# EAGLE design dc_controller_1 (EAGLE 4.16)
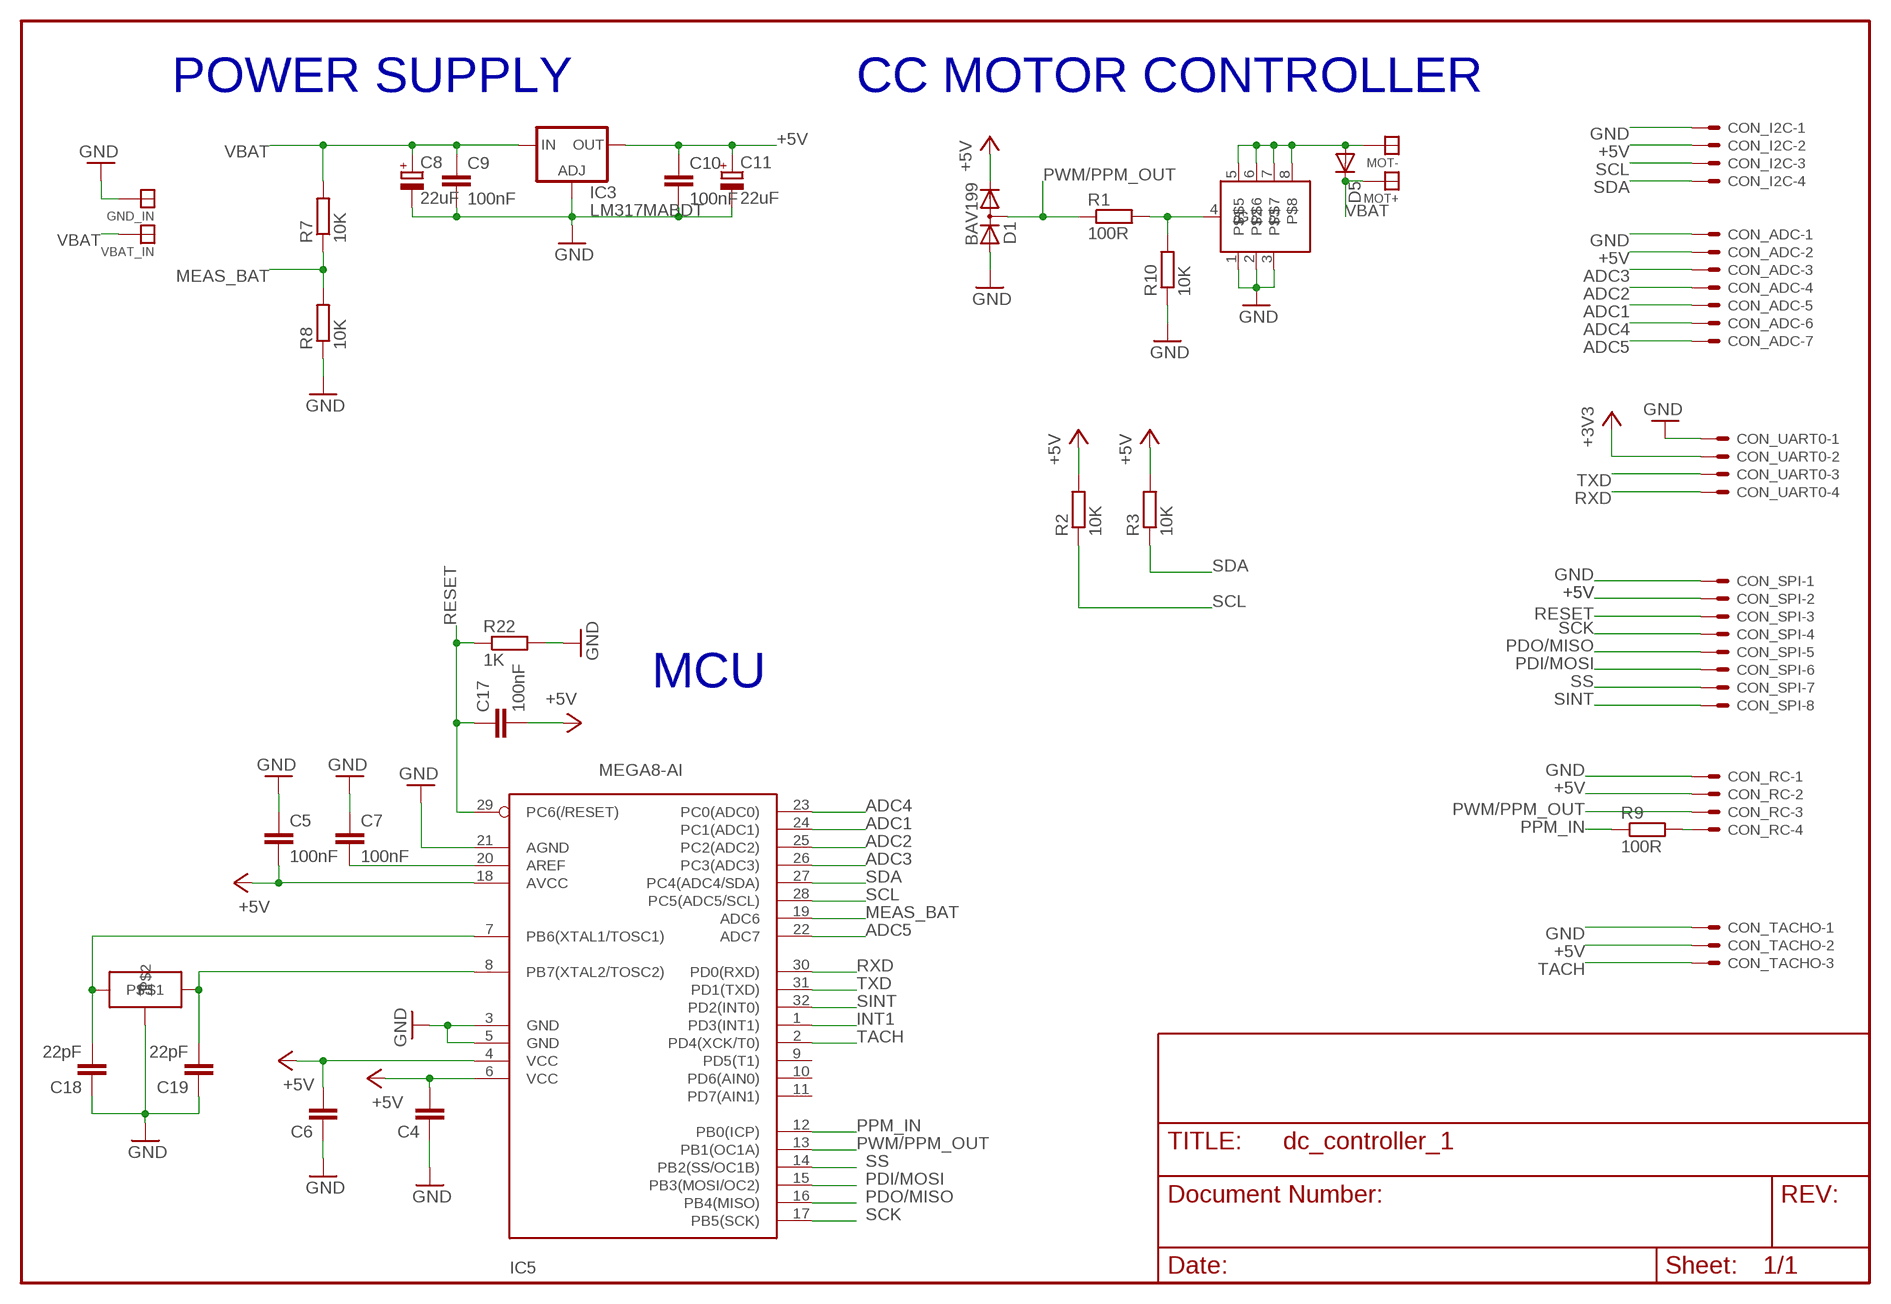
[diagram p0: schematic, sheet 1]

## Parts
C4  C-EUC0805K  [C0805K]
C5  100nF  C-EUC0805K  [C0805K]
C6  C-EUC0805K  [C0805K]
C7  100nF  C-EUC0805K  [C0805K]
C8  22uF  CPOL-EUD/7343-31R  [D/7343-31R]
C9  100nF  C-EUC0805K  [C0805K]
C10  100nF  C-EUC0805K  [C0805K]
C11  22uF  CPOL-EUD/7343-31R  [D/7343-31R]
C17  100nF  C-EUC0805K  [C0805K]
C18  22pF  C-EUC0805K  [C0805K]
C19  22pF  C-EUC0805K  [C0805K]
CON_ADC  53047-07  [53047-07]
CON_I2C  53047-04  [53047-04]
CON_RC  53047-04  [53047-04]
CON_SPI  53047-08  [53047-08]
CON_TACHO  53047-03  [53047-03]
CON_UART0  53047-04  [53047-04]
D1  BAV199  [SOT23]
D5  DIODE-DO214BA  [DO-214BA]
GND_IN  SOLDER_PAD200_50  [SOLDER_PAD_200_50]
IC3  LM317MABDT  [DPACK]
IC5  MEGA8-AI  [TQFP32-08]
MOT+  SOLDER_PAD200_50  [SOLDER_PAD_200_50]
MOT-  SOLDER_PAD200_50  [SOLDER_PAD_200_50]
R1  100R  R-EU_R0805  [R0805]
R2  10K  R-EU_R0805  [R0805]
R3  10K  R-EU_R0805  [R0805]
R7  10K  R-EU_R0805  [R0805]
R8  10K  R-EU_R0805  [R0805]
R9  100R  R-EU_R0805  [R0805]
R10  10K  R-EU_R0805  [R0805]
R22  1K  R-EU_R0805  [R0805]
U$4  IRF7809  [SO08]
U$9  MICRO_RESO  [MICRO_CRYSTAL]
VBAT_IN  SOLDER_PAD200_50  [SOLDER_PAD_200_50]

## Nets
+5V: C4.2 C5.2 C6.2 C10.1 C11.+ C17.2 CON_ADC.2 CON_I2C.2 CON_RC.2 CON_SPI.2 CON_TACHO.2 CON_UART0.2 D1.2(C) IC3.4(OUT) IC5.4(VCC) IC5.6(VCC) IC5.18(AVCC) R2.2 R3.2 ; supply symbol labelled +3V3
ADC1: CON_ADC.5 IC5.24(PC1(ADC1))
ADC2: CON_ADC.4 IC5.25(PC2(ADC2))
ADC3: CON_ADC.3 IC5.26(PC3(ADC3))
ADC4: CON_ADC.6 IC5.23(PC0(ADC0))
ADC5: CON_ADC.7 IC5.22(ADC7)
GND: C4.1 C5.1 C6.1 C7.1 C8.- C9.2 C10.2 C11.- C18.1 C19.1 CON_ADC.1 CON_I2C.1 CON_RC.1 CON_SPI.1 CON_TACHO.1 CON_UART0.1 D1.1(A) GND_IN.P$1 IC3.1(ADJ) IC5.3(GND) IC5.5(GND) IC5.21(AGND) R8.1 R10.1 R22.2 U$4.1 U$4.2 U$4.3 U$9.P$2
INT1: IC5.1(PD3(INT1))
MEAS_BAT: IC5.19(ADC6) R7.1 R8.2
N$1: C19.2 IC5.8(PB7(XTAL2/TOSC2)) U$9.P$1
N$2: C18.2 IC5.7(PB6(XTAL1/TOSC1)) U$9.P$3
N$3: C7.2 IC5.20(AREF)
N$5: CON_RC.4 R9.2
N$9: R1.2 R10.2 U$4.4(G)
N$13: D5.A MOT-.P$1 U$4.5 U$4.6 U$4.7 U$4.8
PDI/MOSI: CON_SPI.6 IC5.15(PB3(MOSI/OC2))
PDO/MISO: CON_SPI.5 IC5.16(PB4(MISO))
PPM_IN: IC5.12(PB0(ICP)) R9.1
PWM/PPM_OUT: CON_RC.3 D1.3(AC) IC5.13(PB1(OC1A)) R1.1
RESET: C17.1 CON_SPI.3 IC5.29(PC6(/RESET)) R22.1
RXD: CON_UART0.4 IC5.30(PD0(RXD))
SCK: CON_SPI.4 IC5.17(PB5(SCK))
SCL: CON_I2C.3 IC5.28(PC5(ADC5/SCL)) R2.1
SDA: CON_I2C.4 IC5.27(PC4(ADC4/SDA)) R3.1
SINT: CON_SPI.8 IC5.32(PD2(INT0))
SS: CON_SPI.7 IC5.14(PB2(SS/OC1B))
TACH: CON_TACHO.3 IC5.2(PD4(XCK/T0))
TXD: CON_UART0.3 IC5.31(PD1(TXD))
VBAT: C8.+ C9.1 D5.C IC3.3(IN) MOT+.P$1 R7.2 VBAT_IN.P$1
Unconnected: IC5.9(PD5(T1)) IC5.10(PD6(AIN0)) IC5.11(PD7(AIN1))

## Notes on the sheet
- POWER SUPPLY | CC MOTOR CONTROLLER
- MCU

## Library data of the parts
C4-C7 C9 C10 C17-C19 = rcl:C-EU: CAPACITOR, European symbol
C8 C11 = rcl:CPOL-EU: POLARIZED CAPACITOR, European symbol
CON_ADC = con-molex:53?-07: CONNECTOR wire to board 1.25 mm (.049 inch) pitch header
CON_I2C CON_RC CON_UART0 = con-molex:53?-04: CONNECTOR wire to board 1.25 mm (.049 inch) pitch header
CON_SPI = con-molex:53?-08: CONNECTOR wire to board 1.25 mm (.049 inch) pitch header
CON_TACHO = con-molex:53?-03: CONNECTOR wire to board 1.25 mm (.049 inch) pitch header
D1 = diode:BAV199: DIODE low-leakage double diode
D5 = diode:DIODE-: DIODE
GND_IN MOT+ MOT- VBAT_IN = paparazzi:SOLDER_PAD
IC3 = v-reg:LM317?*: 500 mA Adjustable Output Positive Voltage Regulator Source: http://www.onsemi.co.jp .. LM317M-D.PDF
IC5 = atmel:MEGA8: MICROCONTROLLER 8 Kbytes FLASH 1 kbytes SRAM 512 bytes EEPROM USART 6-channel 10 bit ADC 2-channel 8 bit ADC
R1-R3 R7-R10 R22 = rcl:R-EU_: RESISTOR, European symbol
U$4 = paparazzi:IRF7809
U$9 = paparazzi:MICRO_RESO

## Board
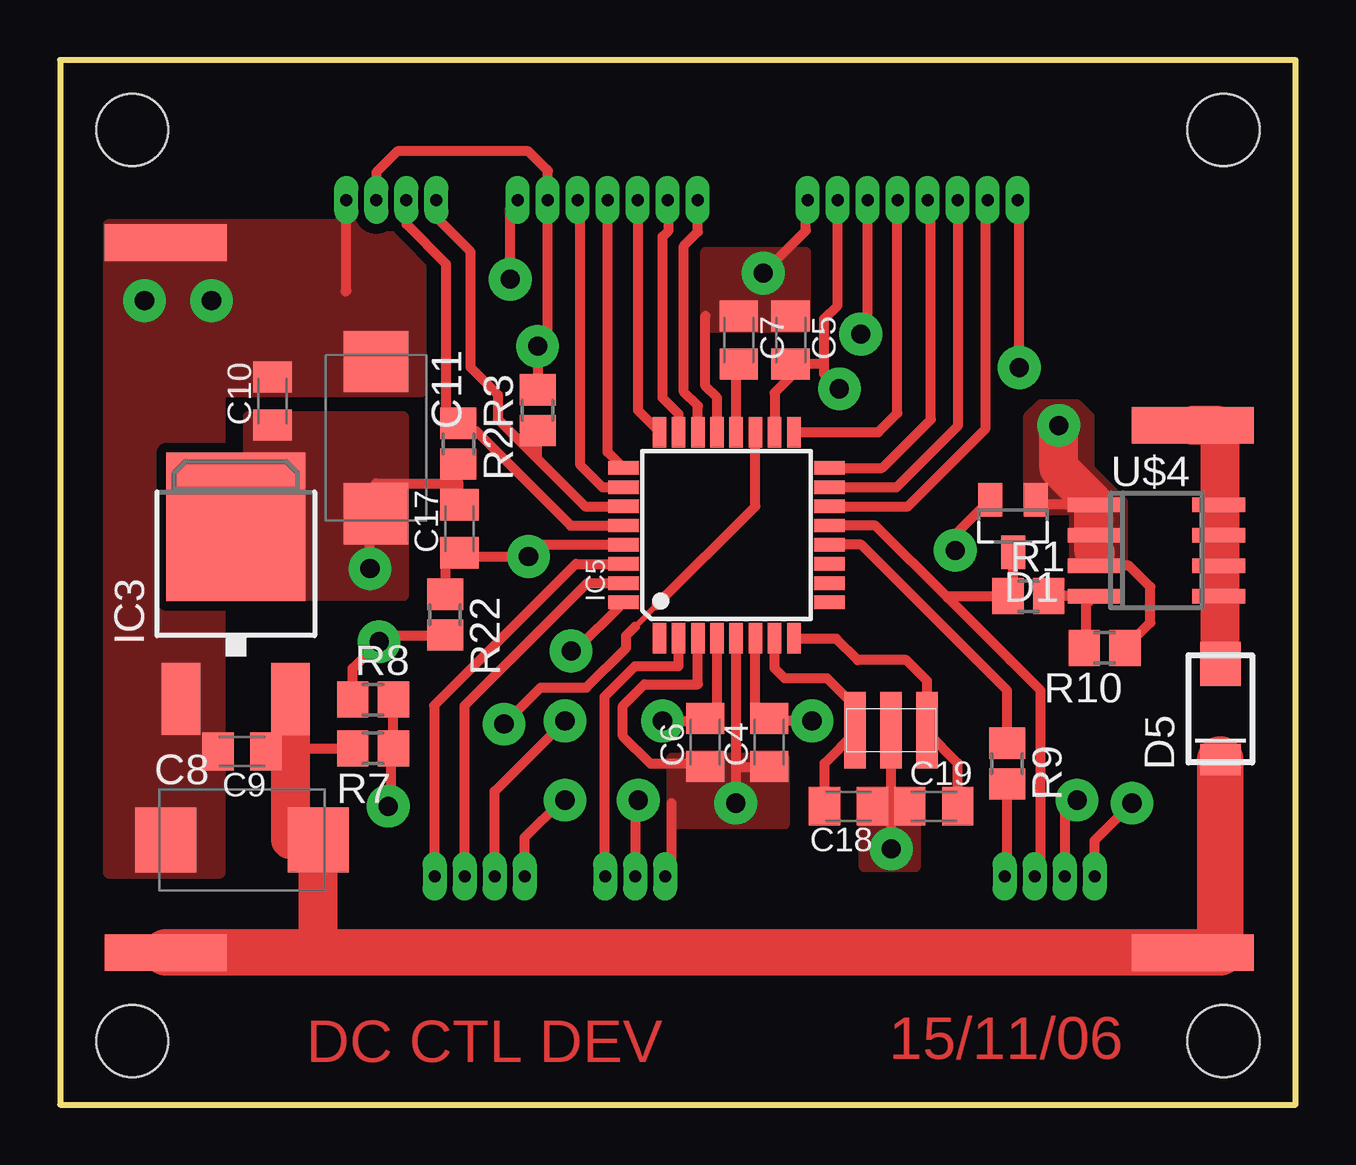
[diagram p1: board, top side]
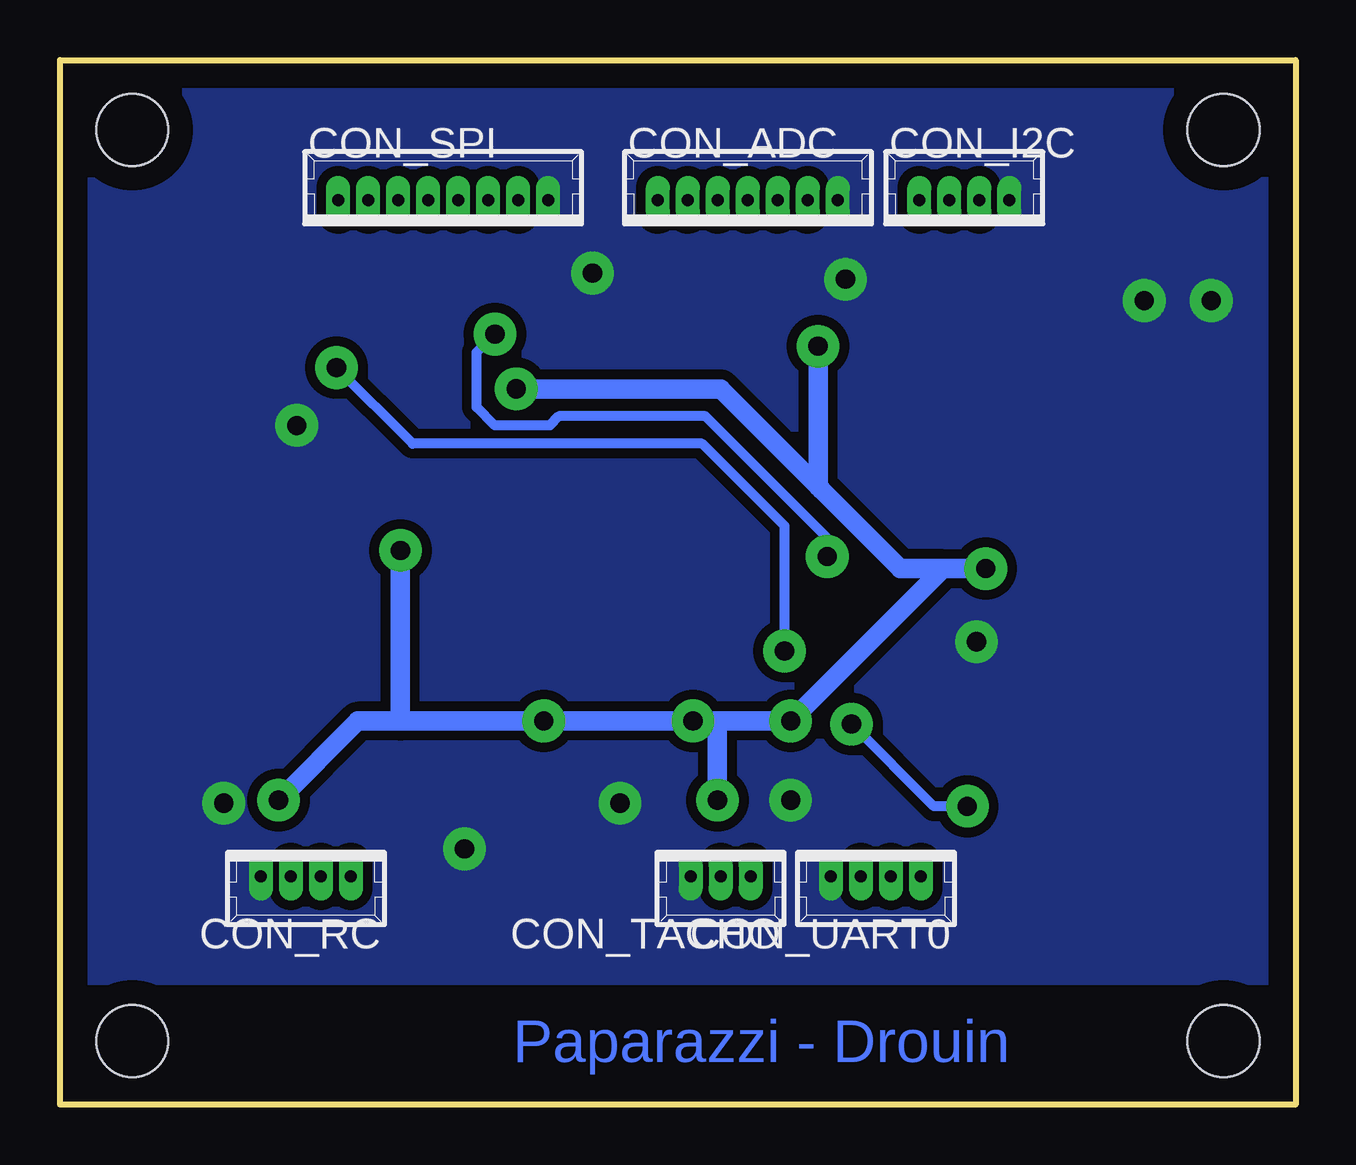
[diagram p2: board, bottom side, seen from below]

Size 51.49 x 43.55 mm. Coordinates in mm from the lower left corner, seen from the top.
Outline: 0,0 51.49,0 51.49,43.55 0,43.55 0,0
Copper layers (1*16): Top 0.035mm / dielectric 1.5mm / Bottom 0.035mm
Design rules "default": minimum track width 10mil, minimum drill 24mil, track to track 8mil, track to pad 8mil, pad to pad 8mil, via to via 8mil, smd to smd 8mil, copper to edge 40mil, drill to drill 8mil, minimum pad ring 10mil, minimum via ring 8mil, stop-mask expansion 4mil, vias tented up to drill 0mil, thermal gap 10mil
Holes 3 mm at 3.01,2.66 48.48,40.63 48.48,2.66 3.01,40.63

### Footprints (pad centres in the part's own frame; a part is rotated, then mirrored left to right if it is on the bottom)
C0805K = smd 1.3 x 1.6: 1 -1,0; 2 1,0
D/7343-31R = smd 2.55 x 2.7: + 3.175,0; - -3.175,0
53047-07 = drill 0.5 pad 0.698 long: 1 3.75,0; 2 2.5,0; 3 1.25,0; 4 0,0; 5 -1.25,0; 6 -2.5,0; 7 -3.75,0
53047-04 = drill 0.5 pad 0.698 long: 1 1.875,0; 2 0.625,0; 3 -0.625,0; 4 -1.875,0
53047-08 = drill 0.5 pad 0.698 long: 1 4.375,0; 2 3.125,0; 3 1.875,0; 4 0.625,0; 5 -0.625,0; 6 -1.875,0; 7 -3.125,0; 8 -4.375,0
53047-03 = drill 0.5 pad 0.698 long: 1 1.25,0; 2 0,0; 3 -1.25,0
SOT23 = smd 1 x 1.4: 1 -0.95,-1.1; 2 0.95,-1.1; 3 0,1.1
DO-214BA = smd 1.85 x 1.68: A 1.87,0 | smd 1.32 x 1.68: C -2.12,0
SOLDER_PAD_200_50 = smd 5.08 x 1.524: P$1 0,0
DPACK = smd 1.6 x 3: 1 -2.28,-4.8; 3 2.28,-4.8 | smd 5.8 x 6.2: 4 0,2.38
TQFP32-08 = smd 1.27 x 0.559: 1 -4.293,2.8; 2 -4.293,2; 3 -4.293,1.2; 4 -4.293,0.4; 5 -4.293,-0.4; 6 -4.293,-1.2; 7 -4.293,-2; 8 -4.293,-2.8; 17 4.293,-2.8; 18 4.293,-2; 19 4.293,-1.2; 20 4.293,-0.4; 21 4.293,0.4; 22 4.293,1.2; 23 4.293,2; 24 4.293,2.8 | smd 0.559 x 1.27: 9 -2.8,-4.293; 10 -2,-4.293; 11 -1.2,-4.293; 12 -0.4,-4.293; 13 0.4,-4.293; 14 1.2,-4.293; 15 2,-4.293; 16 2.8,-4.293; 25 2.8,4.293; 26 2,4.293; 27 1.2,4.293; 28 0.4,4.293; 29 -0.4,4.293; 30 -1.2,4.293; 31 -2,4.293; 32 -2.8,4.293
R0805 = smd 1.3 x 1.5: 1 -0.85,0; 2 0.85,0
SO08 = smd 0.6 x 2.2: 1 -1.905,-2.6; 2 -0.635,-2.6; 3 0.635,-2.6; 4 1.905,-2.6; 5 1.905,2.6; 6 0.635,2.6; 7 -0.635,2.6; 8 -1.905,2.6
MICRO_CRYSTAL = smd 0.9 x 3.2: P$1 -1.5,0; P$2 0,0; P$3 1.5,0

### Placement (x,y rotation side)
C4  29.55,15.11 90 top
C5  30.44,31.87 270 top
C6  26.89,15.11 90 top
C7  28.28,31.87 270 top
C8  7.58,11.04 0 top
C9  7.58,14.73 180 top
C10  8.85,29.33 90 top
C11  13.17,27.81 270 top
C17  16.64,24.01 90 top
C18  32.85,12.44 180 top
C19  36.41,12.44 0 top
CON_ADC  22.82,37.71 0 bottom
CON_I2C  13.8,37.71 0 bottom
CON_RC  41.24,9.52 180 bottom
CON_SPI  35.52,37.71 0 bottom
CON_TACHO  23.96,9.52 180 bottom
CON_UART0  17.49,9.52 180 bottom
D1  39.71,24.12 180 top
D5  48.35,16.5 90 top
GND_IN  4.41,35.94 180 top
IC3  7.33,21.71 0 top
IC5  27.78,23.74 90 top
MOT+  4.41,6.34 0 top
MOT-  47.21,28.32 180 top
R1  40.35,21.2 0 top
R2  16.6,27.55 270 top
R3  19.9,28.95 90 top
R7  13.04,14.85 180 top
R8  13.04,16.89 0 top
R9  39.46,14.22 270 top
R10  43.52,19.05 180 top
R22  16.05,20.43 270 top
U$4  45.68,23.11 270 top
U$9  34.63,15.62 180 top
VBAT_IN  47.21,6.34 0 top

### Tracks (layer width: path | path; a pad name or v marks a point on that pad's centre or on a via)
+5V  (via drill 0.8 pad 1.78)
  Top 0.406: IC5.6 28.98,16.7 29.55,16.12 C4.2 29.66,16 v31.33,16 | 26.89,16 C6.2 | IC5.4 27.38,16.49 26.89,16 | v25.11,16 26.89,16 | CON_TACHO.2 23.96,12.57 v24.09,12.7 | CON_UART0.2 18.11,13.07 v21.04,16 | IC5.18 29.78,29.68 30.44,30.35 C5.2 | C5.2 30.44,30.98 | CON_RC.2 41.86,12.18 v42.38,12.7 | CON_SPI.2 32.4,33.32 31.84,32.76 31.84,30.86 | v12.92,22.35 12.92,25.52 | R3.2 v19.9,31.62 20.33,32.05 20.33,37.66 20.28,37.71 CON_ADC.2 20.32,38.94 20.28,38.98 | C11.+ 13.17,25.9 16.6,25.9 | 16.6,25.9 R2.2 | C17.2 16.6,25.01 16.6,25.9 | CON_I2C.2 13.18,38.87 14.06,39.75 19.52,39.75 20.28,38.98 | 20.28,38.98 20.33,38.93 | D1.2 37.3,23.76 v37.3,23.11 | 31.84,30.86 31.84,30.47 v32.47,29.84 | C5.2 31.82,30.87 31.84,30.86
  Bottom 0.813: 24.09,16 v21.04,16 14.69,22.35 | 24.09,16 v25.11,16 v31.33,16 37.3,16 | 24.09,16 v24.09,12.7 | 37.3,16 39.08,16 v42.38,12.7 | 19.77,25.65 16.47,22.35 14.69,22.35 | 19.77,25.65 19.9,25.78 v19.9,31.62 | 14.69,22.35 v12.92,22.35 | 37.3,16 v37.3,23.11 | v32.47,29.84 23.96,29.84 19.77,25.65
  pour Top (isolate 0.406, no thermals): 4.92,26.92 7.84,26.92 7.84,28.7 14.31,28.7 14.31,21.2 4.66,21.2 4.66,26.92 5.04,26.92
ADC1
  Top 0.406: 24.98,28.06 | IC5.24 24.98,28.06 | 24.98,28.06 24.09,28.94 24.09,37.71 CON_ADC.5
ADC2
  Top 0.406: 23.07,26.54 IC5.25 22.82,27.2 22.82,34.54 CON_ADC.4
ADC3
  Top 0.406: IC5.26 22.6,25.74 21.68,26.66 21.68,37.59 21.55,37.71 CON_ADC.3
ADC4
  Top 0.406: IC5.23 25.78,28.79 25.11,29.46 25.11,36.19 25.36,36.44 25.36,37.71 CON_ADC.6
ADC5
  Top 0.406: IC5.22 26.57,29.13 26,29.71 26,35.81 26.58,36.39 26.58,37.66 26.63,37.71 CON_ADC.7
GND  (via drill 0.8 pad 1.78)
  Top 0.406: 35.52,12.44 C19.1 34.63,12.44 | 34.63,12.44 C18.1 | 34.63,12.57 34.63,12.44 | 34.63,12.57 U$9.P$2 | C4.1 29.55,14.09 28.18,14.09 | 28.18,14.09 IC5.5 | IC5.3 26.57,17.52 24.35,17.52 23.46,16.63 23.46,15.36 24.6,14.22 26.89,14.22 C6.1 | 28.18,14.09 28.18,12.59 v28.16,12.57 | CON_TACHO.1 25.49,9.79 25.49,12.57 | v34.63,10.66 34.63,12.57 | v21.04,12.7 20.92,12.7 19.36,11.14 CON_UART0.1 | IC5.21 27.38,29.48 26.89,29.97 26.89,32.89 | CON_RC.1 43.11,11.01 v44.67,12.57 | CON_SPI.1 31.08,37.71 31.08,36.44 v29.3,34.67 | 43.14,22.98 42.89,22.73 42.89,22.47 U$4.3 44.54,22.47 45.43,21.59 45.43,20.1 R10.1 | 43.08,23.11 43.14,23.11 43.08,23.17 U$4.2 | 43.08,24.38 43.02,24.38 43.08,24.45 U$4.1 40.86,25.01 40.66,25.21 D1.1 | R8.1 12.19,18.2 v13.3,19.3 13.55,19.55 16.08,19.55 | 16.08,19.55 16.09,19.55 | 16.08,19.55 R22.2 | CON_ADC.1 19.14,37.71 18.76,37.33 v18.76,34.41 | CON_I2C.1 11.93,33.93 11.9,33.9
  Top 1.626: 43.14,22.98 43.08,23.04 43.08,23.11 U$4.2 43.08,24.38 U$4.1 43.08,25.07 41.62,26.54 v41.62,28.32
  other vias: 3.52,33.52 6.31,33.52
  pour Top (no thermals): 30.19,14.47 30.19,11.68 25.49,11.68 25.49,14.47
  pour Top (no thermals): 33.49,12.95 35.65,12.95 35.65,9.9 33.49,9.9
  pour Top (no thermals): 26.89,35.55 31.08,35.55 31.08,32.38 26.89,32.38
  pour Bottom (isolate 0.406, no thermals): 0.34,43.17 51.27,43.17 51.27,5.2 0.34,5.2
  pour Top (isolate 0.406, no thermals): 1.99,9.65 6.69,9.65 6.69,29.71 15.07,29.71 15.07,36.7 1.99,36.7
  pour Top (no thermals): 40.35,24.76 40.35,28.7 40.86,29.2 42.38,29.2 42.89,28.7 42.89,26.54 44.28,25.14 44.28,22.47 42.25,22.47 42.25,24.76
MEAS_BAT  (via drill 0.8 pad 1.78)
  Top 0.254: 23.96,19.93 24.85,20.82
  Top 0.406: R8.2 13.93,16.89 13.89,16.85 R7.1 13.8,14.85 13.8,12.44 v13.68,12.44 | IC5.19 28.98,24.94 24.85,20.82 | v18.5,15.87 20.03,17.39 21.93,17.39 23.58,19.05 23.58,19.55 23.96,19.93
  Bottom 0.406: v18.5,15.87 15.07,12.44 v13.68,12.44
N$1
  Top 0.406: C19.2 37.41,14.23 36.13,15.51 U$9.P$1 36.13,17.67 35.27,18.54 33.24,18.54 32.35,19.43 30.57,19.43 IC5.8
N$2
  Top 0.406: IC5.7 29.78,18.19 30.19,17.78 31.97,17.78 33.11,16.63 33.11,15.62 U$9.P$3 33.13,15.51 31.86,14.23 C18.2
N$3
  Top 0.406: C7.2 28.28,30.98 28.18,30.88 IC5.20
N$5
  Top 0.406: 39.46,13.46 R9.2 39.46,9.62 CON_RC.4
N$9
  Top 0.406: R1.2 U$4.4 42.76,20.88 42.76,19.05 R10.2
N$13
  Top 0.406: 48.48,25.01 48.35,25.01 U$4.8 | 48.73,23.74 48.35,23.74 U$4.7 | 48.73,22.47 48.35,22.47 U$4.6 | 48.35,21.33 48.22,21.33 48.28,21.27 U$4.5
  Top 1.626: D5.A 48.35,21.33 48.35,22.47 48.35,23.74 48.35,25.01 48.35,28.19 48.22,28.32 MOT-.P$1
PDI/MOSI
  Top 0.406: IC5.15 34.85,25.74 37.43,28.32 37.43,37.71 CON_SPI.6
PDO/MISO
  Top 0.406: IC5.16 34.26,26.54 36.28,28.57 36.28,37.59 36.16,37.71 CON_SPI.5
PPM_IN
  Top 0.406: IC5.12 33.38,23.34 39.46,17.27 R9.1
PWM/PPM_OUT
  Top 0.406: D1.3 39.71,21.42 R1.1 37.05,21.2 36.98,21.14 | CON_RC.3 40.86,9.76 40.86,17.27 39.59,18.54 | 39.59,18.54 39.6,18.53 | IC5.13 33.98,24.14 36.98,21.14 | 39.59,18.54 36.98,21.14
RESET  (via drill 0.8 pad 1.78)
  Top 0.406: IC5.29 20.01,23.34 v19.52,22.86 16.8,22.86 C17.1 16.63,23.01 16.05,22.43 R22.1 | CON_SPI.3 33.65,32.41 v33.36,32.13
  Bottom 0.406: v33.36,32.13 34.12,31.36 34.12,29.08 33.36,28.32 31.08,28.32 30.7,28.7 24.6,28.7 19.52,23.62 v19.52,22.86
RXD
  Top 0.406: CON_UART0.4 15.61,16.6 15.58,16.63 21.5,22.54 IC5.30
SCK
  Top 0.406: IC5.17 34.1,28.04 34.89,28.82 CON_SPI.4
SCL
  Top 0.406: IC5.28 21.28,24.14 17.36,28.06 16.6,28.06 R2.1 16.6,28.44 16.09,28.95 16.09,35.05 14.44,36.7 CON_I2C.3
SDA
  Top 0.406: IC5.27 21.88,24.94 19.9,26.92 | CON_I2C.4 15.71,37.71 15.71,36.95 17.11,35.55 17.11,30.73 18.25,29.59 18.25,28.57 19.9,26.92 | R3.1 19.86,28.06 19.86,26.96 19.9,26.92
SINT  (via drill 0.8 pad 1.78)
  Top 0.406: CON_SPI.8 39.97,37.64 v39.97,30.73 | IC5.32 21.43,18.89 v21.3,18.92
  Bottom 0.406: v39.97,30.73 36.79,27.55 24.73,27.55 21.3,24.12 v21.3,18.92
SS
  Top 0.406: IC5.14 35.32,24.94 38.57,28.19 38.57,37.59 38.7,37.71 CON_SPI.7
TACH
  Top 0.406: IC5.2 25.78,18.28 23.96,18.28 22.7,17.01 22.7,9.54 CON_TACHO.3
TXD
  Top 0.406: IC5.31 21.96,21.74 16.86,16.64 CON_UART0.3
VBAT
  Top 0.406: 9.74,14.09 9.61,14.73 C9.1 | 9.61,14.35 9.49,13.71 | 9.49,14.85 9.61,14.85 R7.2
  Top 1.626: 10.76,6.34 C8.+ 9.61,11.04 9.61,14.35 9.61,14.73 9.61,14.85 IC3.3 | IC3.3 9.61,17.01 | IC3.3
  Top 1.93: MOT+.P$1 10.76,6.34 VBAT_IN.P$1 48.35,6.34 D5.C

### Text on the board
Top: DC CTL DEV | 15/11/06
Bottom: Paparazzi - Drouin